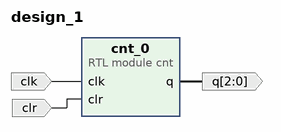
[diagram p0: block diagram of the top level]
# Vivado block design design_1, xc7s6cpga196-1, Vivado 2018.2
create_bd_design design_1

create_bd_port -dir I -type clk clk
set_property -dict {CONFIG.FREQ_HZ 100000000} [get_bd_ports clk]
create_bd_port -dir I clr
create_bd_port -dir O -from 2 -to 0 q

create_bd_cell -type module -reference cnt cnt_0

# ---- connections ----

connect_bd_net [get_bd_ports clk] [get_bd_pins cnt_0/clk]
connect_bd_net [get_bd_ports clr] [get_bd_pins cnt_0/clr]
connect_bd_net [get_bd_pins cnt_0/q] [get_bd_ports q]

validate_bd_design
save_bd_design
